# Altium schematic sheet Mainboard_Wifi_Interface.SchDoc
size A4
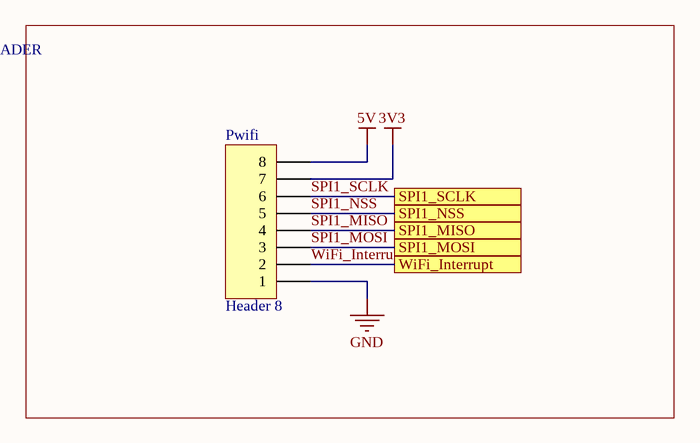
[diagram p0: Mainboard_Wifi_Interface.SchDoc]

## Parts
Pwifi  Header 8  [HDR1X8]

## Blocks framed on the sheet
WIFI INTERFACE HEADER: Pwifi

## Ports
SPI1_MISO, SPI1_MOSI, SPI1_NSS, SPI1_SCLK, WiFi_Interrupt

## Nets
3V3: Pwifi.7
5V: Pwifi.8
GND: Pwifi.1
SPI1_MISO: Pwifi.4 ; port SPI1_MISO
SPI1_MOSI: Pwifi.3 ; port SPI1_MOSI
SPI1_NSS: Pwifi.5 ; port SPI1_NSS
SPI1_SCLK: Pwifi.6 ; port SPI1_SCLK
WiFi_Interrupt: Pwifi.2 ; port WiFi_Interrupt

## Library data of the parts
Pwifi = Header 8: Header, 8-Pin; LatestRevisionDate: 17-Jul-2002; LatestRevisionNote: Re-released for DXP Platform.; Publisher: Altium Limited